# Altium project SpeedControlPID.PrjPCB
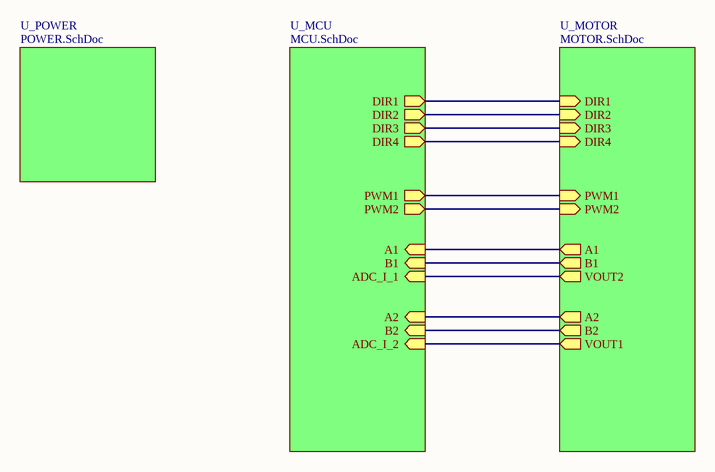
[diagram p0: CONN.SchDoc]
4 sheets, 54 parts. Net scope: hierarchical (ports join the sheet entries above them; power ports are global).
Board file: SpeedControlPID.PcbDoc
Sheets:
  CONN.SchDoc
    U_MCU = MCU.SchDoc
    U_MOTOR = MOTOR.SchDoc
    U_POWER = POWER.SchDoc

## Sheet CONN.SchDoc: =ProjectName
size A4; CheckedBy: DatNB; Author: Ven; CompanyName: Nacentech; Organization: IMET

### Sub-sheets
U_MCU = MCU.SchDoc: DIR1 (out), DIR2 (out), DIR3 (out), DIR4 (out), A1 (in), B1 (in), ADC_I_1 (in), PWM1 (out), PWM2 (out), ADC_I_2 (in), A2 (in), B2 (in)
U_MOTOR = MOTOR.SchDoc: DIR1 (in), DIR2 (in), DIR3 (in), DIR4 (in), A1 (out), B1 (out), A2 (out), B2 (out), VOUT2 (out), VOUT1 (out), PWM2 (in), PWM1 (in)
U_POWER = POWER.SchDoc: no entries

### Nets
ADC_I_1: sheet U_MCU/ADC_I_1, sheet U_MOTOR/VOUT2
ADC_I_2: sheet U_MCU/ADC_I_2, sheet U_MOTOR/VOUT1
ENCODER_A1: sheet U_MCU/A1, sheet U_MOTOR/A1
ENCODER_A2: sheet U_MCU/A2, sheet U_MOTOR/A2
ENCODER_B1: sheet U_MCU/B1, sheet U_MOTOR/B1
ENCODER_B2: sheet U_MCU/B2, sheet U_MOTOR/B2
MOTOR_DIR1: sheet U_MCU/DIR1, sheet U_MOTOR/DIR1
MOTOR_DIR2: sheet U_MCU/DIR2, sheet U_MOTOR/DIR2
MOTOR_DIR3: sheet U_MCU/DIR3, sheet U_MOTOR/DIR3
MOTOR_DIR4: sheet U_MCU/DIR4, sheet U_MOTOR/DIR4
PWM1: sheet U_MCU/PWM1, sheet U_MOTOR/PWM1
PWM2: sheet U_MCU/PWM2, sheet U_MOTOR/PWM2

### Notes on the sheet
- Project:
- Page Contents:
- Size:
- Date:
- A4
- Checked by:
- Time:
- Revision:
- Sheet
- of
- File:

## Sheet MCU.SchDoc: =ProjectName
size A4; CheckedBy: DatNB; Author: Ven; CompanyName: Nacentech; Organization: IMET
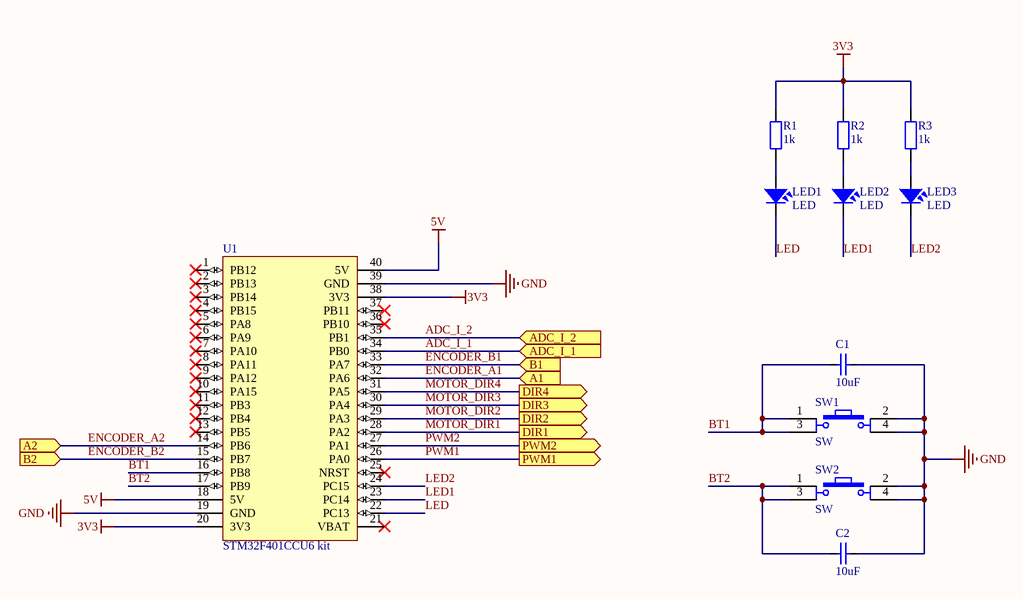
[diagram p1: MCU.SchDoc]

### Parts
C1  10uF  [CAP_0805]
C2  10uF  [CAP_0805]
LED1  LED  [LED-0805-Red]
LED2  LED  [LED-0805-Orange]
LED3  LED  [LED-0805-Green]
R1  1k  [RES-SMD-0805]
R2  1k  [RES-SMD-0805]
R3  1k  [RES-SMD-0805]
SW1  SW  [SW4]
SW2  SW  [SW4]
U1  STM32F401CCU6 kit  [STM32F401 KIT]

### Ports
A1 (in), A2 (in), ADC_I_1 (in), ADC_I_2 (in), B1 (in), B2 (in), DIR1 (out), DIR2 (out), DIR3 (out), DIR4 (out), PWM1 (out), PWM2 (out)

### Nets
3V3: R1.1 R2.1 R3.1 U1.20(3V3) U1.38(3V3)
5V: U1.18(5V) U1.40(5V)
GND: C1.2 C2.2 SW1.2 SW1.4 SW2.2 SW2.4 U1.19(GND) U1.39(GND)
ADC_I_1: U1.34(PB0) ; port ADC_I_1
ADC_I_2: U1.35(PB1) ; port ADC_I_2
BT1: C1.1 SW1.1 SW1.3 U1.16(PB8)
BT2: C2.1 SW2.1 SW2.3 U1.17(PB9)
ENCODER_A1: U1.32(PA6) ; port A1
ENCODER_A2: U1.14(PB6) ; port A2
ENCODER_B1: U1.33(PA7) ; port B1
ENCODER_B2: U1.15(PB7) ; port B2
LED: LED1.2 U1.22(PC13)
LED1: LED2.2 U1.23(PC14)
LED2: LED3.2 U1.24(PC15)
MOTOR_DIR1: U1.28(PA2) ; port DIR1
MOTOR_DIR2: U1.29(PA3) ; port DIR2
MOTOR_DIR3: U1.30(PA4) ; port DIR3
MOTOR_DIR4: U1.31(PA5) ; port DIR4
PWM1: U1.26(PA0) ; port PWM1
PWM2: U1.27(PA1) ; port PWM2
NetLED1_1: LED1.1 R1.2
NetLED2_1: LED2.1 R2.2
NetLED3_1: LED3.1 R3.2

Not connected (* = marked no-connect by the designer): U1 1(PB12)* 2(PB13)* 3(PB14)* 4(PB15)* 5(PA8)* 6(PA9)* 7(PA10)* 8(PA11)* 9(PA12)* 10(PA15)* 11(PB3)* 12(PB4)* 13(PB5)* 21(VBAT)* 25(NRST)* 36(PB10)* 37(PB11)*

### Notes on the sheet
- Project:
- Page Contents:
- Size:
- Date:
- A4
- Checked by:
- Time:
- Revision:
- Sheet
- of
- File:

### Library data of the parts
C1 C2 = CapSMD: Capacitor; Value: 33p; Published: 8-Jun-2000; LatestRevisionDate: 17-Jul-2002; LatestRevisionNote: Re-released for DXP Platform.; PackageReference: RAD-0.3; Publisher: Altium Limited
LED1-LED3 = LED: LED Single colour Green and Red; Value: LED 3 ly Single Colour
R1-R3 = Resistor - SMD: Resistor SMD; Manufacturer: Generic Components; Class: Passive; Published: 08/06/2000; Publisher: Altium Hobart Technology Centre
SW1 SW2 = SW4: Switch button 4 pin; Value: Button chip 4 pin
U1 = STM32F401CCU6: STM32F401CCU6 breakout board. STM32 ARM-based 32-bit MCU

## Sheet MOTOR.SchDoc: =ProjectName
size A4; CheckedBy: DatNB; Author: Ven; CompanyName: Nacentech; Organization: IMET
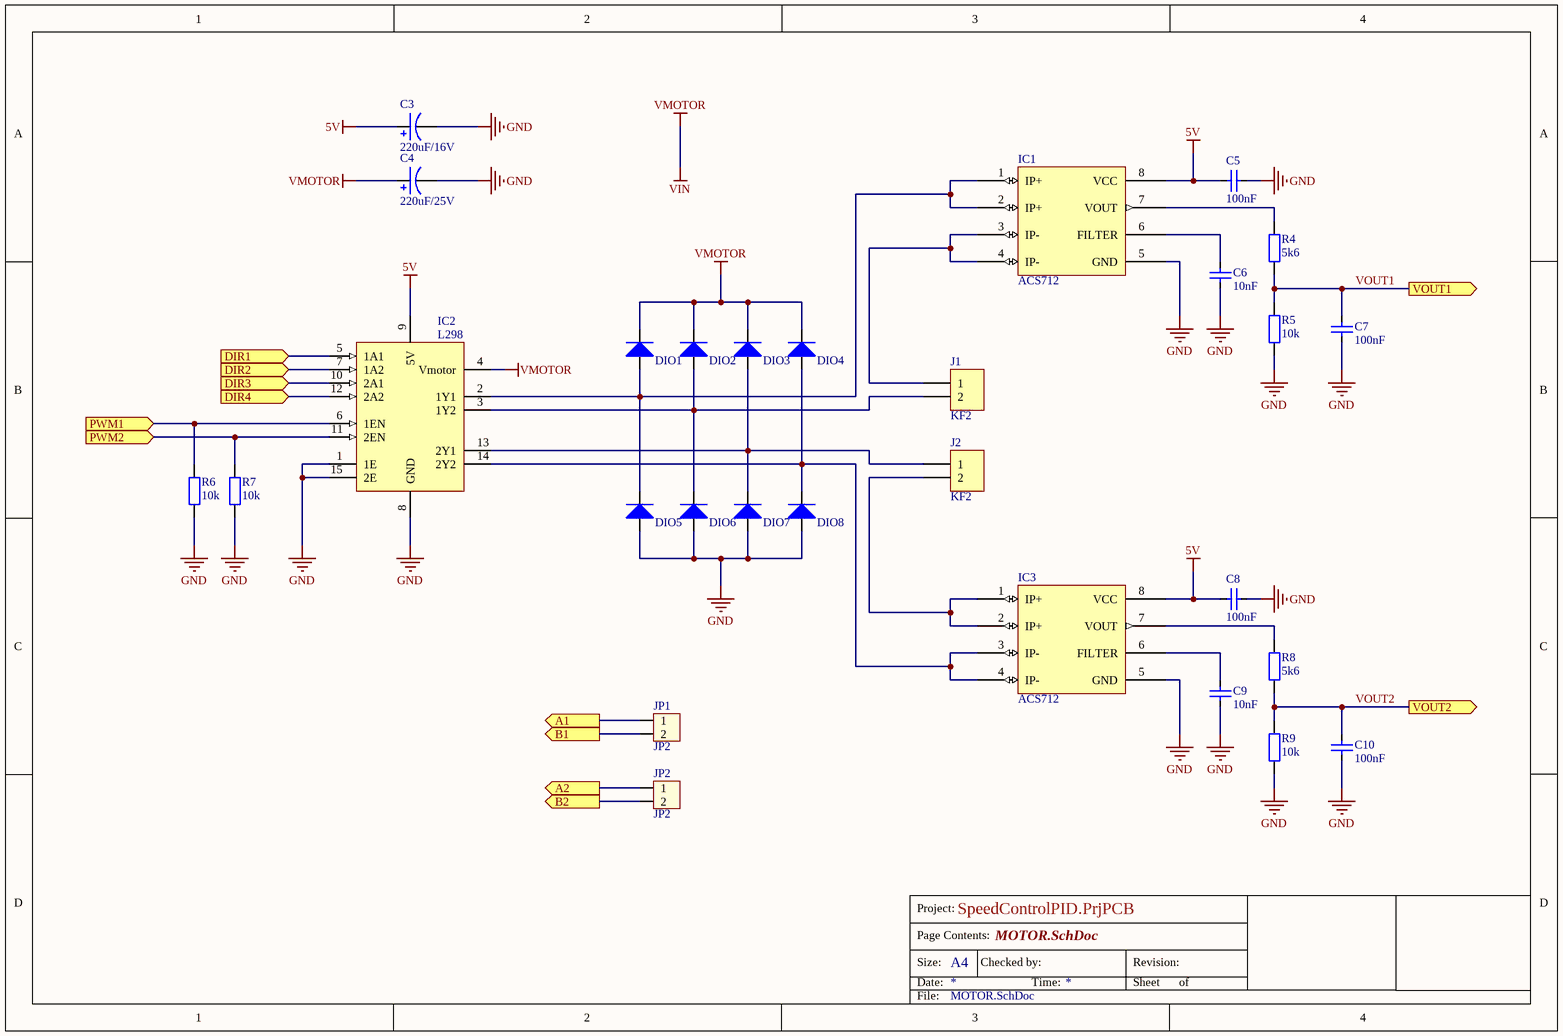
[diagram p2: MOTOR.SchDoc]

### Parts
C3  220uF/16V  [C8mm]
C4  220uF/25V  [C8mm]
C5  100nF  [CAP_0805]
C6  10nF  [CAP_0805]
C7  100nF  [CAP_0805]
C8  100nF  [CAP_0805]
C9  10nF  [CAP_0805]
C10  100nF  [CAP_0805]
DIO1  Diode SMD  [DIO-214AC(SMA)]  (value not drawn)
DIO2  Diode SMD  [DIO-214AC(SMA)]  (value not drawn)
DIO3  Diode SMD  [DIO-214AC(SMA)]  (value not drawn)
DIO4  Diode SMD  [DIO-214AC(SMA)]  (value not drawn)
DIO5  Diode SMD  [DIO-214AC(SMA)]  (value not drawn)
DIO6  Diode SMD  [DIO-214AC(SMA)]  (value not drawn)
DIO7  Diode SMD  [DIO-214AC(SMA)]  (value not drawn)
DIO8  Diode SMD  [DIO-214AC(SMA)]  (value not drawn)
IC1  ACS712  [SOIC-8]
IC2  L298  [DIP15SL2]
IC3  ACS712  [SOIC-8]
J1  KF2  [KF2-5.08]
J2  KF2  [KF2-5.08]
JP1  JP2  [CON2]
JP2  JP2  [CON2]
R4  5k6  [RES-SMD-0805]
R5  10k  [RES-SMD-0805]
R6  10k  [RES-SMD-0805]
R7  10k  [RES-SMD-0805]
R8  5k6  [RES-SMD-0805]
R9  10k  [RES-SMD-0805]

### Ports
A1 (out), A2 (out), B1 (out), B2 (out), DIR1 (in), DIR2 (in), DIR3 (in), DIR4 (in), PWM1 (in), PWM2 (in), VOUT1 (out), VOUT2 (out)

### Nets
5V: C3.1 C5.2 C8.2 IC1.8(VCC) IC2.9(5V) IC3.8(VCC)
GND: C3.2 C4.2 C5.1 C6.1 C7.1 C8.1 C9.1 C10.1 DIO5.1(A) DIO6.1(A) DIO7.1(A) DIO8.1(A) IC1.5(GND) IC2.1(1E) IC2.8(GND) IC2.15(2E) IC3.5(GND) R5.2 R6.2 R7.2 R9.2
VIN: C4.1 DIO1.2(K) DIO2.2(K) DIO3.2(K) DIO4.2(K) IC2.4(Vmotor)  [also labelled VMOTOR]
ENCODER_A1: JP1.1 ; port A1
ENCODER_A2: JP2.1 ; port A2
ENCODER_B1: JP1.2 ; port B1
ENCODER_B2: JP2.2 ; port B2
MOTOR_DIR1: IC2.5(1A1) ; port DIR1
MOTOR_DIR2: IC2.7(1A2) ; port DIR2
MOTOR_DIR3: IC2.10(2A1) ; port DIR3
MOTOR_DIR4: IC2.12(2A2) ; port DIR4
PWM1: IC2.6(1EN) R6.1 ; port PWM1
PWM2: IC2.11(2EN) R7.1 ; port PWM2
VOUT1: C7.2 R4.2 R5.1 ; port VOUT1  [project net ADC_I_2]
VOUT2: C10.2 R8.2 R9.1 ; port VOUT2  [project net ADC_I_1]
NetC6_2: C6.2 IC1.6(FILTER)
NetC9_2: C9.2 IC3.6(FILTER)
NetDIO1_1: DIO1.1(A) DIO5.2(K) IC1.1(IP+) IC1.2(IP+) IC2.2(1Y1)
NetDIO2_1: DIO2.1(A) DIO6.2(K) IC2.3(1Y2) J1.2
NetDIO3_1: DIO3.1(A) DIO7.2(K) IC2.13(2Y1) J2.1
NetDIO4_1: DIO4.1(A) DIO8.2(K) IC2.14(2Y2) IC3.3(IP-) IC3.4(IP-)
NetIC1_3: IC1.3(IP-) IC1.4(IP-) J1.1
NetIC1_7: IC1.7(VOUT) R4.1
NetIC3_1: IC3.1(IP+) IC3.2(IP+) J2.2
NetIC3_7: IC3.7(VOUT) R8.1

### Notes on the sheet
- Project:
- Page Contents:
- Size:
- Date:
- A4
- Checked by:
- Time:
- Revision:
- Sheet
- of
- File:

### Library data of the parts
C3 C4 = Cap Pol: Polarized Capacitor (Axial); Published: 8-Jun-2000; LatestRevisionDate: 17-Jul-2002; LatestRevisionNote: Re-released for DXP Platform.; PackageReference: POLAR0.8; Publisher: Altium Limited
C5-C10 = CapSMD: Capacitor; Value: 33p; Published: 8-Jun-2000; LatestRevisionDate: 17-Jul-2002; LatestRevisionNote: Re-released for DXP Platform.; PackageReference: RAD-0.3; Publisher: Altium Limited
DIO1-DIO8 = Diode SMD: Default Diode; Code - JEDEC: DO-214-AB; Value: 1N5007; Published: 8-Jun-2000; Revision: July-2002: Re-released for DXP Platform.; Publisher: Altium Limited
IC2 = L298: Dual Full-H Driver; Note: The tab is elec is connected to GND pin; Published: 15-May-2002; DatasheetVersion: Jun-1990; PackageReference: KV015; Publisher: Altium Limited; PackageDescription: TO, Thru-Hole, Vertical, Heatsink Mounted; 15 Bent Staggered Leads; Pitch 1.27 mm; ComponentLink1Description: Manufacturer Link; ComponentLink1URL: http://www.ti.com/
J1 J2 = KF2: Manufacturer: Würth Elektronik eiSos GmbH; partNo: 691103110002; ComponentLink1 Description: Manufacturer; ComponentLink2 Description: Datasheet; NoPins: 2; Created Date: 29 October 2013; ComponentLink1URL: http://www.we-online.com; ComponentLink2URL: http://katalog.we-online.de/em/datasheet/6911031100xx.pdf; Created by: Karrer Zheng
JP1 JP2 = Con2: Connector 2; Value: Connector 2
R4-R9 = Resistor - SMD: as R1 on sheet MCU; Published: 08/06/2000; Publisher: Altium Hobart Technology Centre

## Sheet POWER.SchDoc: =ProjectName
size A4; CheckedBy: DatNB; Author: Ven; CompanyName: Nacentech; Organization: IMET
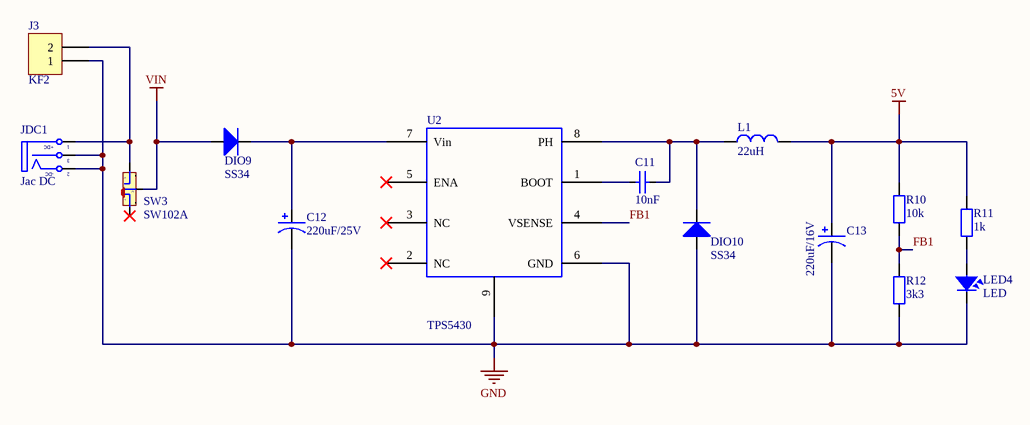
[diagram p3: POWER.SchDoc]

### Parts
C11  10nF  [CAP_0805]
C12  220uF/25V  [C8mm]
C13  220uF/16V  [C8mm]
DIO9  SS34  [DIO-214AC(SMA)]
DIO10  SS34  [DIO-214AC(SMA)]
J3  KF2  [KF2-5.08]
JDC1  Jac DC  [DC-IN]
L1  22uH  [L-SMD-M-7.3x4.5]
LED4  LED  [LED-0805-Red]
R10  10k  [RES-SMD-0805]
R11  1k  [RES-SMD-0805]
R12  3k3  [RES-SMD-0805]
SW3  SW102A  [SW102]
U2  TPS5430  [ESOP-8]

### Nets
5V: C13.1 L1.2 R10.1 R11.1
GND: C12.2 C13.2 DIO10.1(A) J3.1 JDC1.2(TN) JDC1.3(S) LED4.2 R12.2 U2.6(GND) U2.9(PWR_PAD)
VIN: DIO9.1(A) SW3.2
FB1: R10.2 R12.1 U2.4(VSENSE)
NetC11_1: C11.1 U2.1(BOOT)
NetC11_2: C11.2 DIO10.2(K) L1.1 U2.8(PH)
NetC12_1: C12.1 DIO9.2(K) U2.7(Vin)
NetJ3_2: J3.2 JDC1.1(T) SW3.3
NetLED4_1: LED4.1 R11.2

Not connected (* = marked no-connect by the designer): SW3 1* 4 5; U2 2(NC)* 3(NC)* 5(ENA)*

### Notes on the sheet
- Project:
- Page Contents:
- Size:
- Date:
- A4
- Checked by:
- Time:
- Revision:
- Sheet
- of
- File:
- (in symbol DCIN) +DC; -DC

### Library data of the parts
C11 = CapSMD: Capacitor; Value: 33p; Published: 8-Jun-2000; LatestRevisionDate: 17-Jul-2002; LatestRevisionNote: Re-released for DXP Platform.; PackageReference: RAD-0.3; Publisher: Altium Limited
C12 C13 = Cap Pol: Polarized Capacitor (Axial); Published: 8-Jun-2000; LatestRevisionDate: 17-Jul-2002; LatestRevisionNote: Re-released for DXP Platform.; PackageReference: POLAR0.8; Publisher: Altium Limited
DIO9 DIO10 = Diode SMD: as DIO1 on sheet MOTOR; Published: 8-Jun-2000; Revision: July-2002: Re-released for DXP Platform.; Publisher: Altium Limited
J3 = KF2: as J1 on sheet MOTOR; Created Date: 29 October 2013; ComponentLink1URL: http://www.we-online.com; ComponentLink2URL: http://katalog.we-online.de/em/datasheet/6911031100xx.pdf; Created by: Karrer Zheng
JDC1 = DCIN: Jac DC input; Value: Jac DC
L1 = Inductor: Value: 150 mH
LED4 = LED: as LED1 on sheet MCU
R10-R12 = Resistor - SMD: as R1 on sheet MCU; Published: 08/06/2000; Publisher: Altium Hobart Technology Centre
SW3 = SW102A: Switch 102 on Broad; Value: Switch 102 On Board
U2 = TPS5430: Name: TPS5430

## Nets that join several sheets
5V: MCU (U1.18 U1.40), MOTOR (6 pins), POWER (C13.1 L1.2 R10.1 R11.1)
GND: MCU (8 pins), MOTOR (21 pins), POWER (10 pins)
VIN: MOTOR (6 pins), POWER (DIO9.1 SW3.2)
ADC_I_1: MCU (U1.34), MOTOR (C10.2 R8.2 R9.1)
ADC_I_2: MCU (U1.35), MOTOR (C7.2 R4.2 R5.1)
ENCODER_A1: MCU (U1.32), MOTOR (JP1.1)
ENCODER_A2: MCU (U1.14), MOTOR (JP2.1)
ENCODER_B1: MCU (U1.33), MOTOR (JP1.2)
ENCODER_B2: MCU (U1.15), MOTOR (JP2.2)
MOTOR_DIR1: MCU (U1.28), MOTOR (IC2.5)
MOTOR_DIR2: MCU (U1.29), MOTOR (IC2.7)
MOTOR_DIR3: MCU (U1.30), MOTOR (IC2.10)
MOTOR_DIR4: MCU (U1.31), MOTOR (IC2.12)
PWM1: MCU (U1.26), MOTOR (IC2.6 R6.1)
PWM2: MCU (U1.27), MOTOR (IC2.11 R7.1)